# EAGLE schematic PDB2 (EAGLE 9.3.0)

## Sheet 1 of 3: BATTERY MANAGEMENT & OUTPUTS
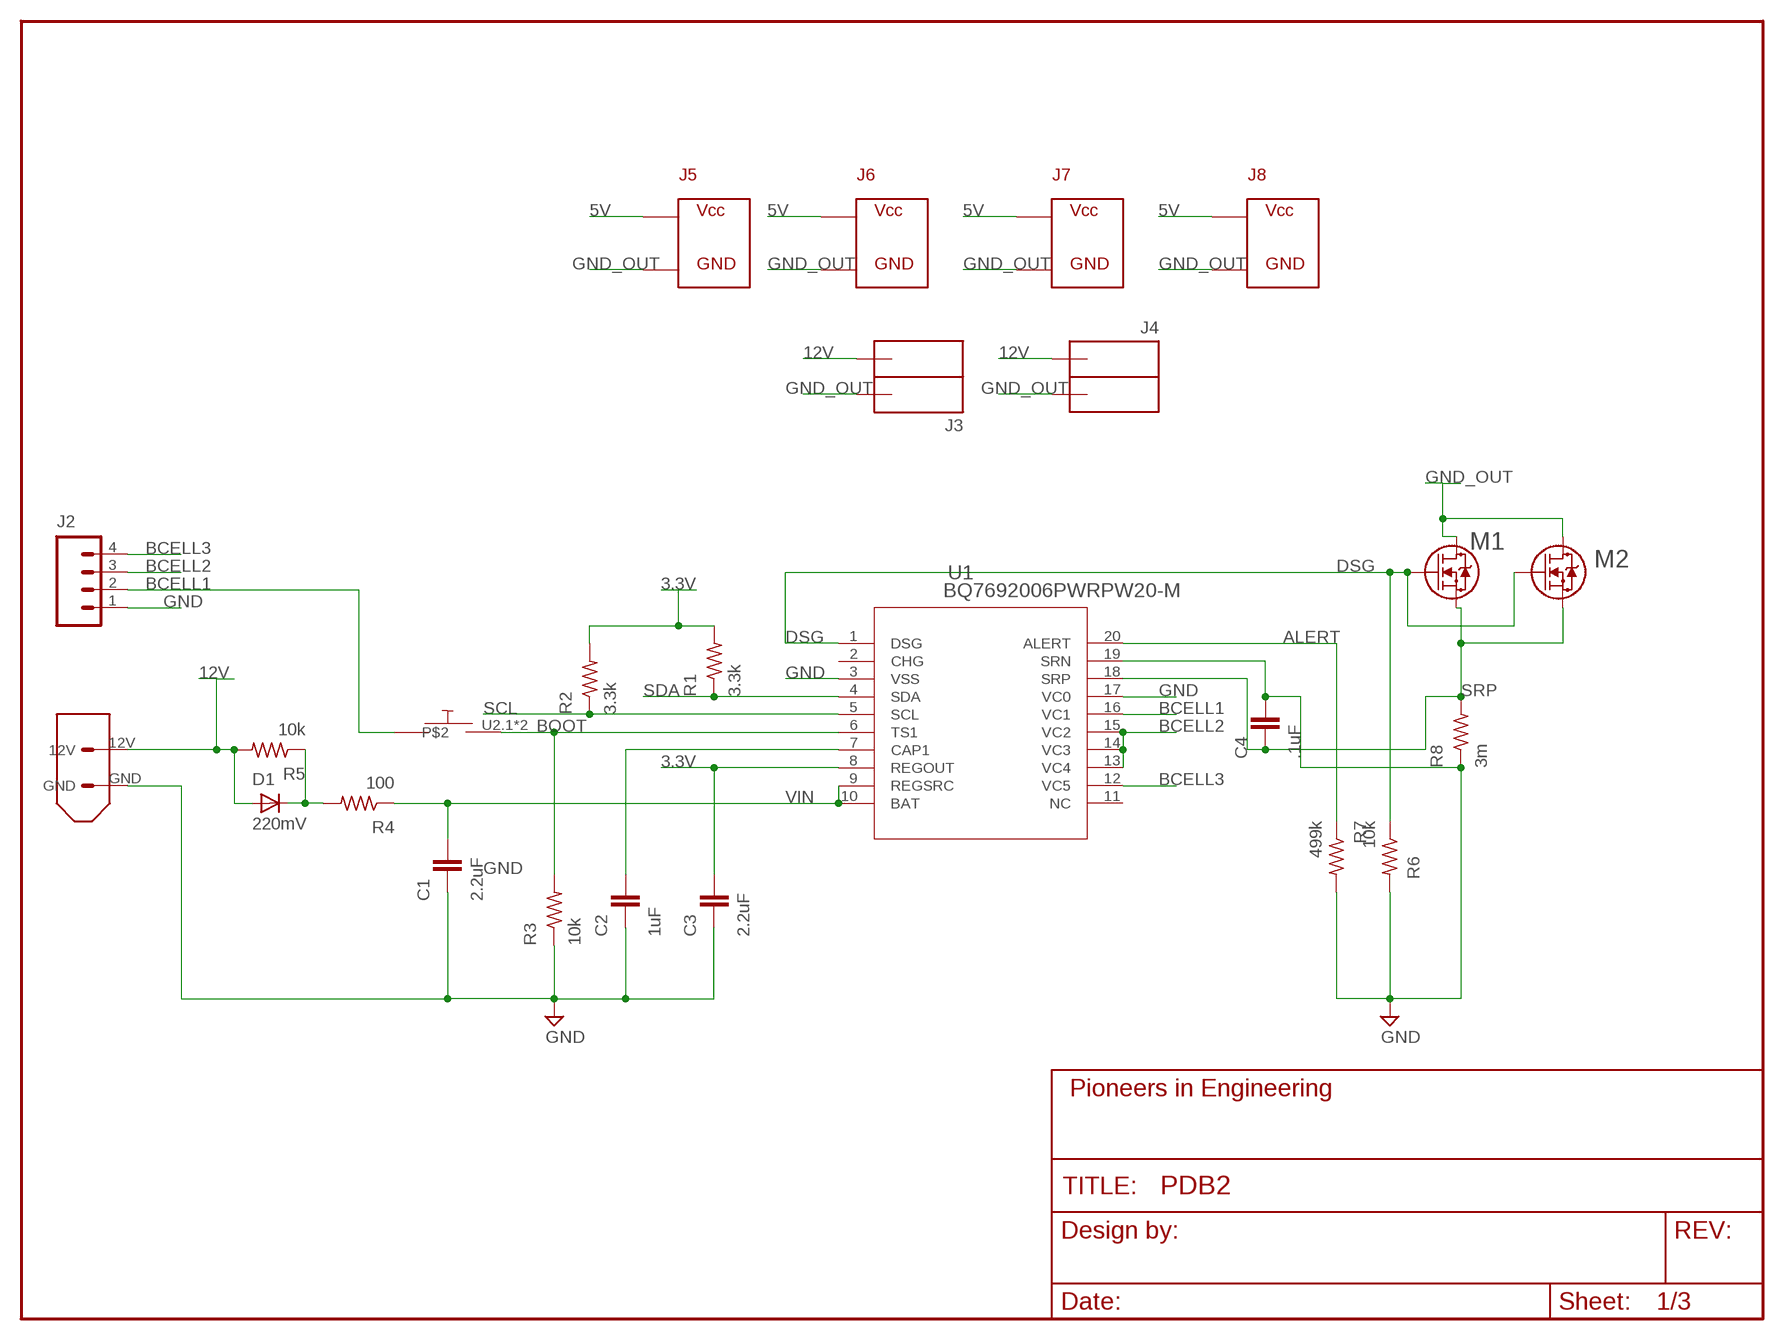
[diagram p0: schematic, sheet 1]
FRAME1 (FRAME_SCHEMATIC): AUTHOR: Sherwin A.

### Parts
BUT1  D6C90F1LFS  [D6C_BUTTON]
C1  2.2uF  CAP0603-CAP  [0603-CAP]
C2  1uF  CAP0603-CAP  [0603-CAP]
C3  2.2uF  CAP0603-CAP  [0603-CAP]
C4  .1uF  CAP0603-CAP  [0603-CAP]
D1  220mV  DIODESOD-323  [SOD-323]
J1  XT60CONNECTOR  [XT60CONNECTOR]
J2  M041X04-MTA  [1X04-MTA]
J3  ANDERSONVERTICAL  [ANDERSON_VERTICAL]
J4  ANDERSONVERTICAL  [ANDERSON_VERTICAL]
J5  ATX  [ATX]
J6  ATX  [ATX]
J7  ATX  [ATX]
J8  ATX  [ATX]
M1  STD20NF06LDPAK-M  [DPAK-M]
M2  STD20NF06LDPAK-M  [DPAK-M]
R1  3.3k  R-US_R0603  [R0603]
R2  3.3k  R-US_R0603  [R0603]
R3  10k  R-US_R0603  [R0603]
R4  100  R-US_R0603  [R0603]
R5  10k  R-US_R0603  [R0603]
R6  10k  R-US_R0603  [R0603]
R7  499k  R-US_R0603  [R0603]
R8  3m  R-US_R2512  [R2512]
U1  BQ7692006PWRPW20-M  [PW20-M]

### Nets
3.3V: C3.2 R1.2 R2.2 U1.8(REGOUT) ; also sheet 3
5V: J5.P$1 J6.P$1 J7.P$1 J8.P$1 ; also sheet 2
12V: D1.1(A) J1.12V J3.PIN1(OUTB) J4.PIN2(OUTA) R5.2 ; also sheet 2
ALERT: R7.1 U1.20(ALERT) ; also sheet 3
BCELL1: BUT1.U1.1 BUT1.U1.2 J2.2 U1.16(VC1)
BCELL2: J2.3 U1.13(VC4) U1.14(VC3) U1.15(VC2)
BCELL3: J2.4 U1.12(VC5)
BOOT: BUT1.U2.1 BUT1.U2.2 R3.2 U1.6(TS1) ; also sheet 3
CAP1: C2.2 U1.7(CAP1)
DSG: M1.1 M2.1 R6.1 U1.1(DSG)
GND: C1.1 C2.1 C3.1 C4.2 J1.GND J2.1 R3.1 R6.2 R7.2 R8.1 U1.3(VSS) U1.17(VC0) U1.19(SRN) ; also sheet 3
GND_OUT: J3.PIN2(OUTA) J4.PIN1(OUTB) J5.P$2 J6.P$2 J7.P$2 J8.P$2 M1.3 M2.3 ; also sheet 2
N$3: D1.2(C) R4.2 R5.1
SCL: R2.1 U1.5(SCL) ; also sheet 3
SDA: R1.1 U1.4(SDA) ; also sheet 3
SRP: C4.1 M1.2 M2.2 R8.2 U1.18(SRP)
VIN: C1.2 R4.1 U1.9(REGSRC) U1.10(BAT)
Unconnected: U1.2(CHG) U1.11(NC)

## Sheet 2 of 3: VOLTAGE REGULATOR
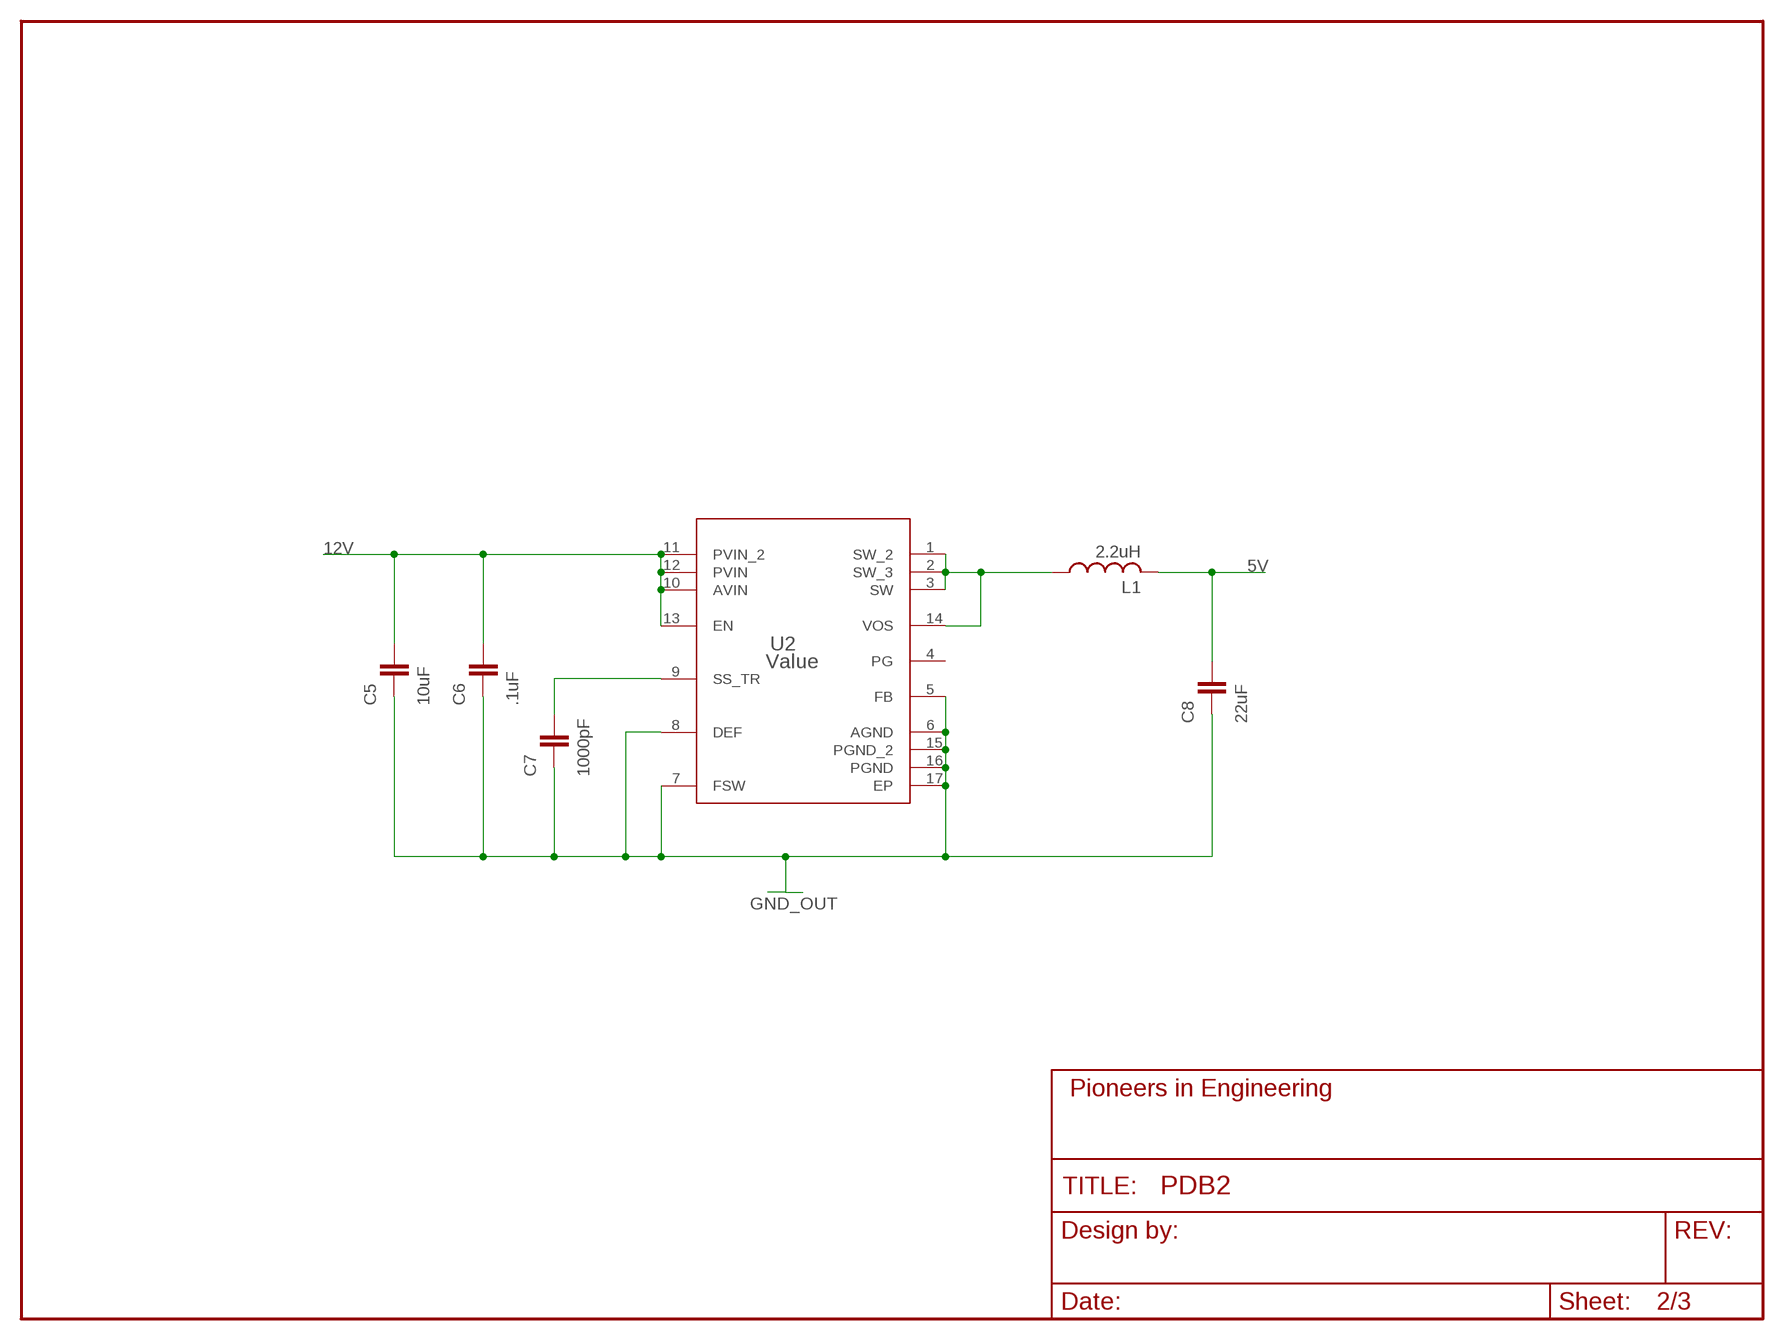
[diagram p1: schematic, sheet 2]

### Parts
C5  10uF  CAP0603-CAP  [0603-CAP]
C6  .1uF  CAP0603-CAP  [0603-CAP]
C7  1000pF  CAP0603-CAP  [0603-CAP]
C8  22uF  CAP0603-CAP  [0603-CAP]
L1  2.2uH  ASPI-0530_INDUCTOR  [ASPI]
U2  Value  TPS62133RGTR  [RGT0016C]

### Nets
5V: C8.2 L1.P$2 ; also sheet 1
12V: C5.2 C6.2 U2.10(AVIN) U2.11(PVIN_2) U2.12(PVIN) U2.13(EN) ; also sheet 1
GND_OUT: C5.1 C6.1 C7.1 C8.1 U2.5(FB) U2.6(AGND) U2.7(FSW) U2.8(DEF) U2.15(PGND_2) U2.16(PGND) U2.17(EP) ; also sheet 1
N$4: L1.P$1 U2.1(SW_2) U2.2(SW_3) U2.3(SW) U2.14(VOS)
N$6: C7.2 U2.9(SS_TR)
Unconnected: U2.4(PG)

## Sheet 3 of 3: DIGITAL INTERFACE
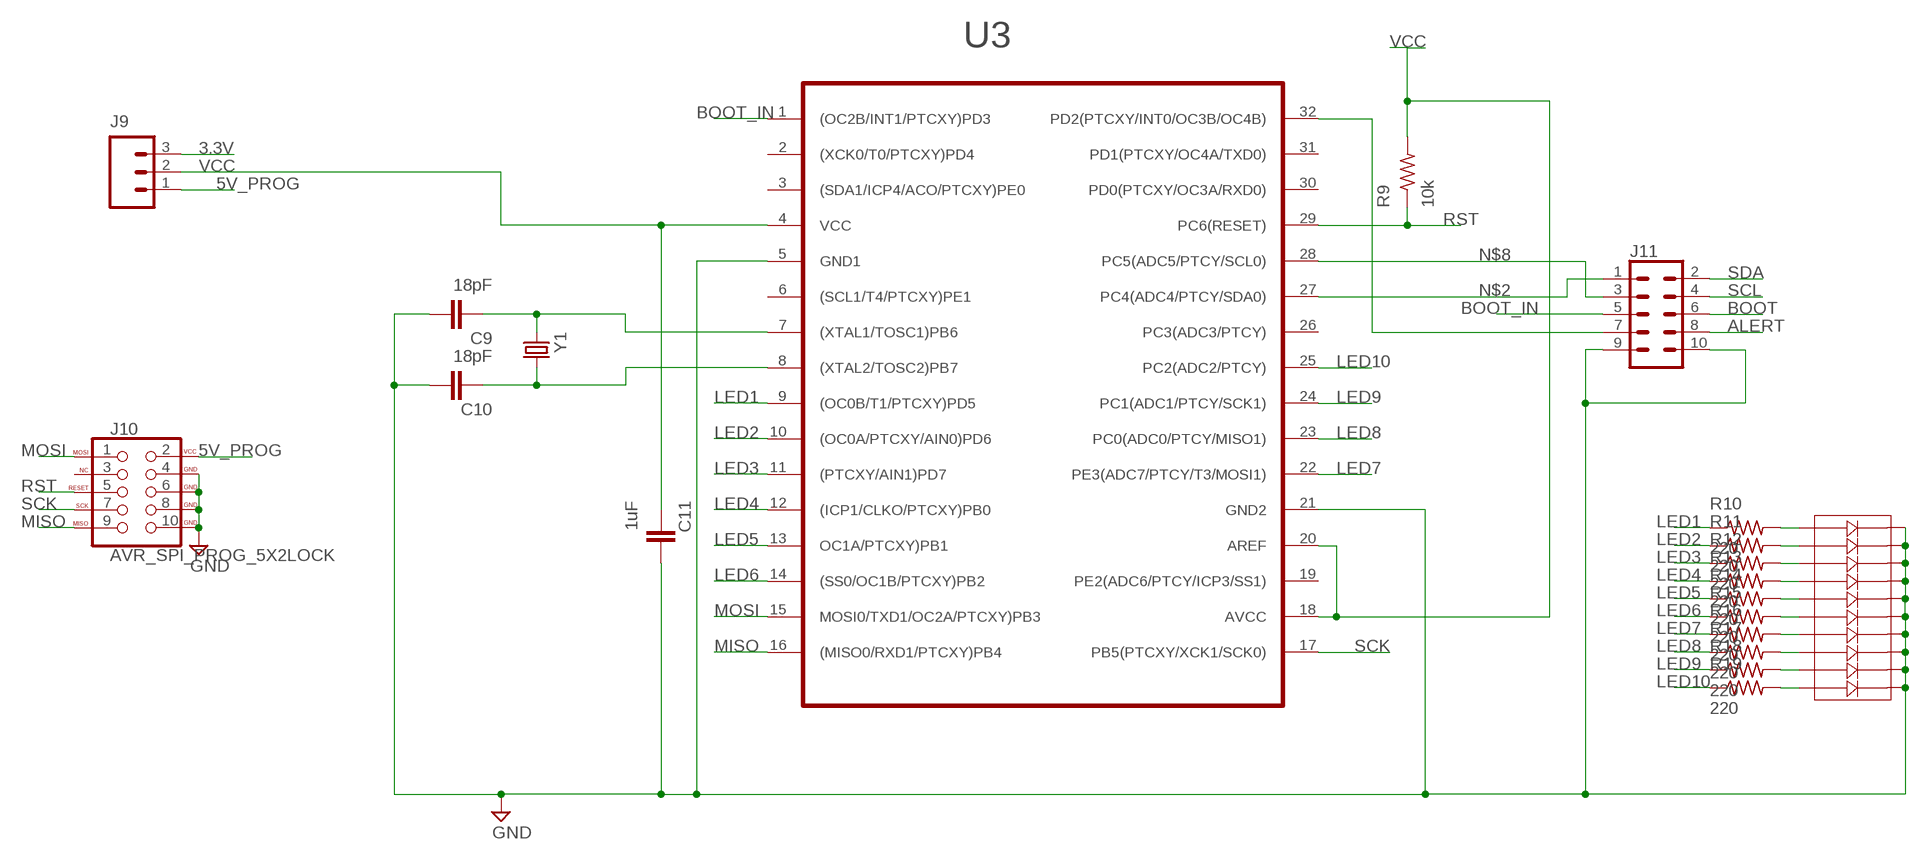
[diagram p2: schematic, sheet 3]

### Parts
C9  18pF  CAP0603-CAP  [0603-CAP]
C10  18pF  CAP0603-CAP  [0603-CAP]
C11  1uF  CAP0603-CAP  [0603-CAP]
J9  M03PTH  [1X03]
J10  AVR_SPI_PROG_5X2LOCK  [2X5-SHROUDED_LOCK]
J11  CONN_05X2NO_SILK  [2X5_NOSILK]
LED1  BAR_SEGMENT_DISPLAY  [BAR_SEGMENT_DISPLAY]
R9  10k  R-US_R0603  [R0603]
R10  220  R-US_R0603  [R0603]
R11  220  R-US_R0603  [R0603]
R12  220  R-US_R0603  [R0603]
R13  220  R-US_R0603  [R0603]
R14  220  R-US_R0603  [R0603]
R15  220  R-US_R0603  [R0603]
R16  220  R-US_R0603  [R0603]
R17  220  R-US_R0603  [R0603]
R18  220  R-US_R0603  [R0603]
R19  220  R-US_R0603  [R0603]
U3  ATMEGA328PB-AU  [TQFP32-08]
Y1  CRYSTALSMD  [HC49UP]

### Nets
3.3V: J9.3 ; also sheet 1
5V_PROG: J9.1 J10.2(VCC)
ALERT: J11.8 ; also sheet 1
BOOT: J11.6 ; also sheet 1
BOOT_IN: J11.5 U3.1((OC2B/INT1/PTCXY)PD3)
GND: C9.2 C10.2 C11.2 J10.4(GND) J10.6(GND) J10.8(GND) J10.10(GND) J11.9 J11.10 LED1.BAR_DISPLAY10(P11) LED1.BAR_DISPLAY11(P12) LED1.BAR_DISPLAY12(P13) LED1.BAR_DISPLAY13(P14) LED1.BAR_DISPLAY14(P15) LED1.BAR_DISPLAY15(P16) LED1.BAR_DISPLAY16(P17) LED1.BAR_DISPLAY17(P18) LED1.BAR_DISPLAY18(P19) LED1.BAR_DISPLAY19(P20) U3.5(GND1) U3.21(GND2) ; also sheet 1
LED1: R10.1 U3.9((OC0B/T1/PTCXY)PD5)
LED2: R11.1 U3.10((OC0A/PTCXY/AIN0)PD6)
LED3: R12.1 U3.11((PTCXY/AIN1)PD7)
LED4: R13.1 U3.12((ICP1/CLKO/PTCXY)PB0)
LED5: R14.1 U3.13(OC1A/PTCXY)PB1)
LED6: R15.1 U3.14((SS0/OC1B/PTCXY)PB2)
LED7: R16.1 U3.22(PE3(ADC7/PTCY/T3/MOSI1))
LED8: R17.1 U3.23(PC0(ADC0/PTCY/MISO1))
LED9: R18.1 U3.24(PC1(ADC1/PTCY/SCK1))
LED10: R19.1 U3.25(PC2(ADC2/PTCY))
MISO: J10.9(MISO) U3.16((MISO0/RXD1/PTCXY)PB4)
MOSI: J10.1(MOSI) U3.15(MOSI0/TXD1/OC2A/PTCXY)PB3)
N$2: J11.1 U3.27(PC4(ADC4/PTCY/SDA0))
N$5: C9.1 U3.7((XTAL1/TOSC1)PB6) Y1.1
N$7: C10.1 U3.8((XTAL2/TOSC2)PB7) Y1.2
N$8: J11.3 U3.28(PC5(ADC5/PTCY/SCL0))
N$11: J11.7 U3.32(PD2(PTCXY/INT0/OC3B/OC4B))
N$12: LED1.BAR_DISPLAY0(P1) R10.2
N$13: LED1.BAR_DISPLAY1(P2) R11.2
N$14: LED1.BAR_DISPLAY2(P3) R12.2
N$15: LED1.BAR_DISPLAY3(P4) R13.2
N$16: LED1.BAR_DISPLAY4(P5) R14.2
N$17: LED1.BAR_DISPLAY5(P6) R15.2
N$18: LED1.BAR_DISPLAY6(P7) R16.2
N$19: LED1.BAR_DISPLAY7(P8) R17.2
N$20: LED1.BAR_DISPLAY8(P9) R18.2
N$21: LED1.BAR_DISPLAY9(P10) R19.2
RST: J10.5(RESET) R9.1 U3.29(PC6(RESET))
SCK: J10.7(SCK) U3.17(PB5(PTCXY/XCK1/SCK0))
SCL: J11.4 ; also sheet 1
SDA: J11.2 ; also sheet 1
VCC: C11.1 J9.2 R9.2 U3.4(VCC) U3.18(AVCC) U3.20(AREF)
Unconnected: J10.3(NC) U3.2((XCK0/T0/PTCXY)PD4) U3.3((SDA1/ICP4/ACO/PTCXY)PE0) U3.6((SCL1/T4/PTCXY)PE1) U3.19(PE2(ADC6/PTCY/ICP3/SS1)) U3.26(PC3(ADC3/PTCY)) U3.30(PD0(PTCXY/OC3A/RXD0)) U3.31(PD1(PTCXY/OC4A/TXD0))

## Library data of the parts
BUT1 = pie:D6C90F1LFS
C1-C11 = pie:CAP: Capacitor Standard 0603 ceramic capacitor, and 0.1" leaded capacitor.; PIE-INT-REF-NUM: CAPACITOR-GENERIC
D1 = pie:DIODE: Diode These are standard reverse protection diodes and small signal diodes. SMA package can handle up to about 1A. SOD-323 can handle about 200mA. What the SOD-323 package when ordering, there are some mfgs out there that are 5-pin packages.; PIE-INT-REF-NUM: DIODE
J1 = pie:XT60CONNECTOR: 12V XT60 power connector; PARTNUMBER: PRT-10474
J2 = pie:M04: 4-pin 0.1-inch header and MTA connector; PIE-INT-REF-NUM: MTA
J3 J4 = pie:ANDERSON: 2-pin 25A Anderson Connector http://www.alliedelec.com/images/products/datasheets/bm/ANDERSON_POWER_PRODUCTS/70162018.pdf; PIE-INT-REF-NUM: Anderson
J5-J8 = pie:ATX: ATX 2 Pin Connector Crimper: http://www.digikey.com/product-detail/en/molex-llc/0640160204/WM17553-ND/2074099 Housing: http://www.digikey.com/product-detail/en/molex-llc/0019092029/WM4382-ND/2421313 Housing (alternative): http://www.digikey.com/product-detail/en/molex-llc/0015311026/WM1041-ND/313614 Connector: http://www.digikey.com/product-detail/en/molex-llc/0019091029/WM1602-ND/26354 Male crimps: http://www.digikey.com/product-detail/en/molex-llc/0002092103/WM1100-ND/26384 Female crimps: http://www.digikey.com/product-detail/en/molex-llc/0002091104/WM1101-ND/26386
J9 = pie:M03: 3-pin 0.1-inch header and MTA connector; PIE-INT-REF-NUM: BULK-STOCK
J10 = SparkFun-Connectors:AVR_SPI_PROG_5X2: AVR 10-pin ICSP Header This is the standard AVR In Circuit Serial Programming header. Minimal, but includes pin one indicator. Works with standard Olimex programmers. SparkFun Products: 2x5 AVR ICSP Male Header <https://www.sparkfun.com/products/778> - PTH 2x5 Pin Shrouded Header <https://www.sparkfun.com/products/8506> - PTH2; PROD_ID: CONN-08671; SF_ID: PRT-08506
J11 = SparkFun-Connectors:CONN_05X2: Multi connection point. Often used as Generic Header-pin footprint for 0.1 inch spaced/style header connections For AVR SPI programming port, see special device with nice symbol: "AVR_SPI_PROG_5x2.dev" You can populate with any combo of single row headers, but if you'd like an exact match, check these: 2x5 AVR ICSP Male Header <https://www.sparkfun.com/products/778> (PRT-00778) 2x5 Pin Shrouded Header <https://www.sparkfun.com/products/8506> (PRT-08506) On any of the 0.1 inch spaced packages, you can populate with these: Break Away Headers - Straight <https://www.sparkfun.com/products/116> (PRT-00116) Break Away Male Headers - Right Angle <https://www.sparkfun.com/products/553> (PRT-00553) Female Headers <https://www.sparkfun.com/products/115> (PRT-00115) Break Away Headers - Machine Pin <https://www.sparkfun.com/products/117> (PRT-00117) Break Away Female Headers - Swiss Machine Pin <https://www.sparkfun.com/products/743> (PRT-00743) Special note: the shrouded connector mates well with our 5x2 ribbon cables: 2x5 Pin IDC Ribbon Cable <https://www.sparkfun.com/products/8535> (PRT-08535)
L1 = pie:ASPI-0530_INDUCTOR
LED1 = pie:BAR_SEGMENT_DISPLAY
M1 M2 = pie:STD20NF06L; MANUFACTURER_PART_NUMBER: STD20NF06L; VENDOR: STMicroelectronics
R1-R7 R9-R19 = pie:R-US_: RESISTOR, American symbol; DESCRIPTION: RESISTOR, American symbol; DISTRIBUTOR: DigiKey; MANUFACTURER: Rohm Semiconductor; NOTES: Cut Tape; PACKAGE: R0603; VALUE: >VALUE
R8 = pie:R-US_: RESISTOR, American symbol; PIE-INT-REF-NUM: RESISTOR-GENERIC
U1 = pie:BQ7692006PWR; MANUFACTURER_PART_NUMBER: BQ7692006PWR; VENDOR: Texas Instruments
U2 = pie:TPS62133RGTR; MANUFACTURER: Texas Instruments; MANUFACTURER_NAME: Texas Instruments; MANUFACTURER_PART_NUMBER: TPS62133RGTR; PARTNUMBER: TPS62133RGTR; REFDES: RefDes; TYPE: TYPE
U3 = pie:ATMEGA328PB-AU
Y1 = pie:CRYSTAL: Various standard crystals. Proven footprints. Spark Fun Electronics SKU : COM-00534; PARTNO: ABLS-8.000MHZ-B4-T; PIE-INT-REF-NUM: CRYSTAL